# Altium schematic sheet 数粒机接收板4通道.SchDoc
size A1
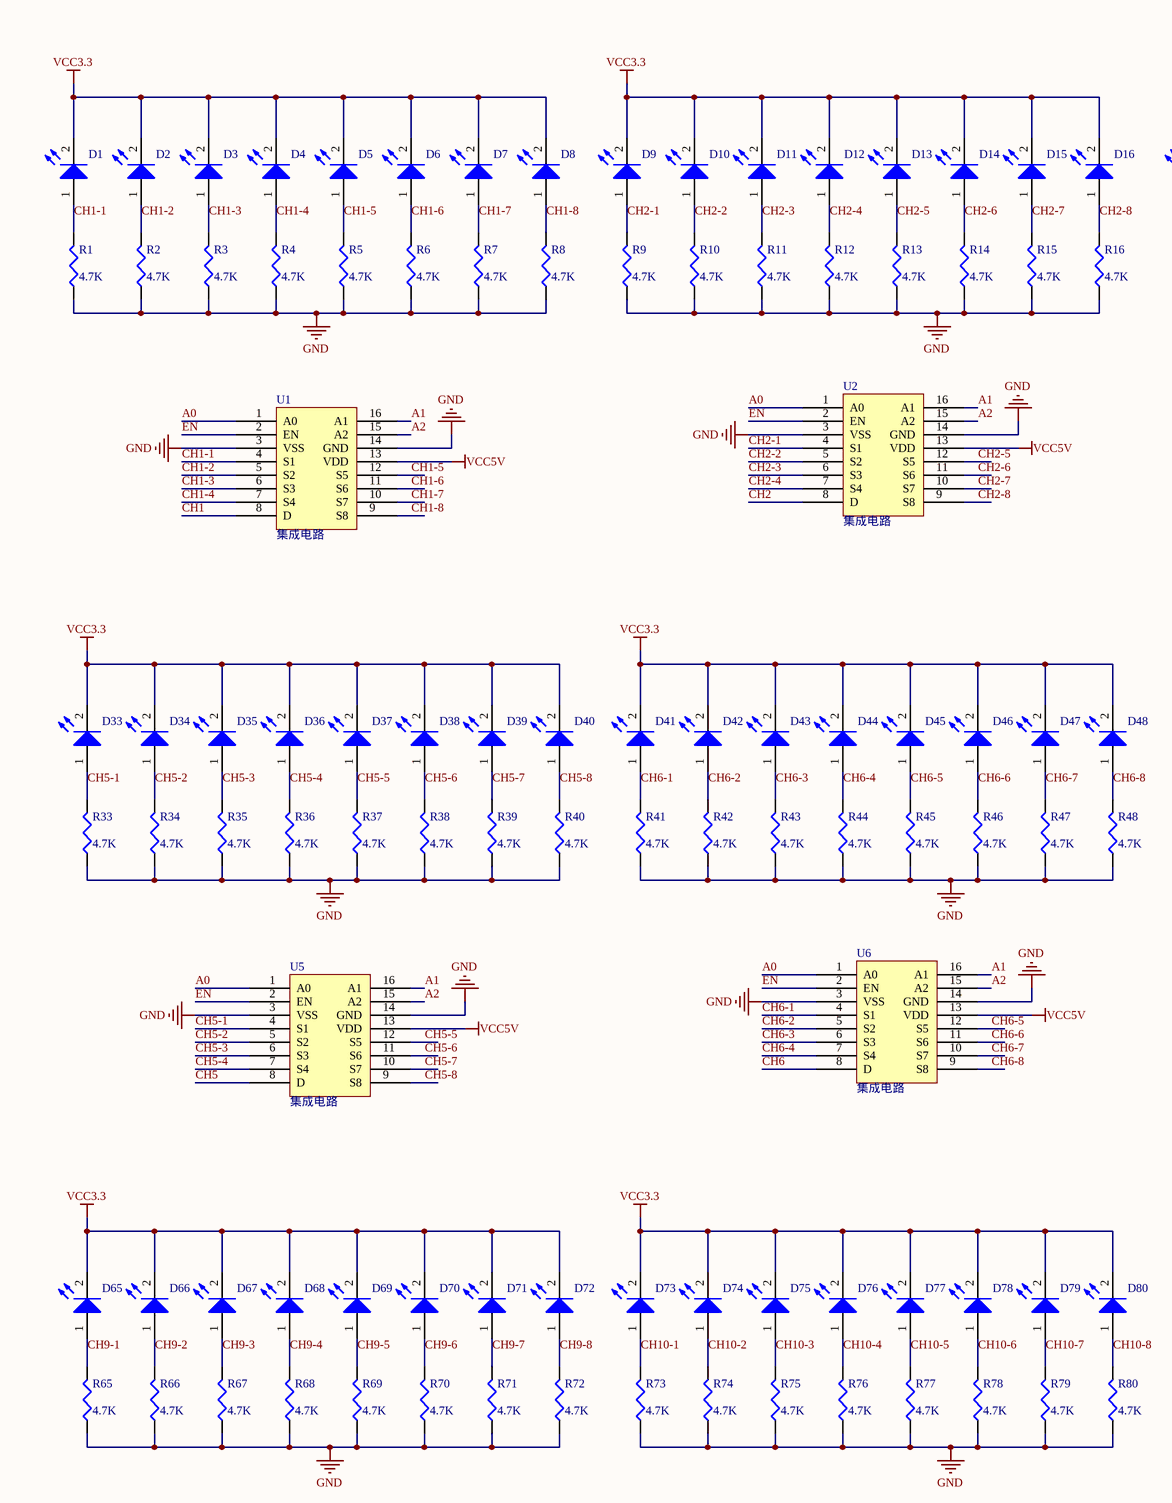
[diagram p0: 数粒机接收板4通道.SchDoc, top left]
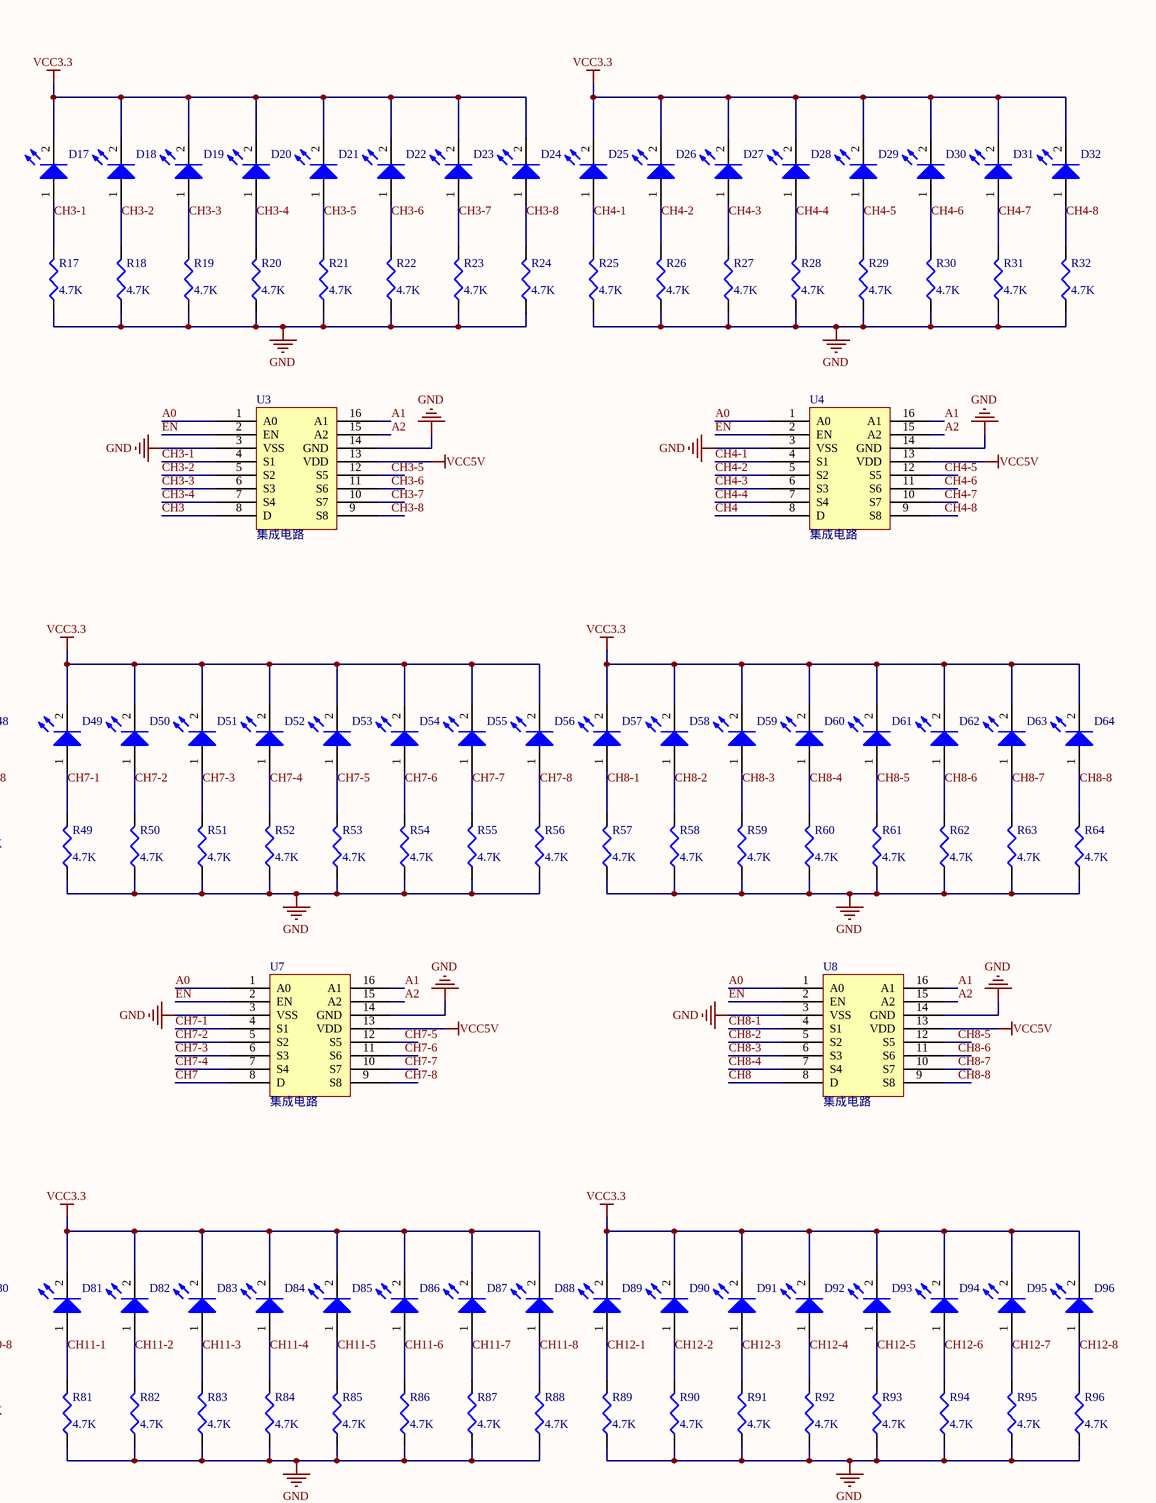
[diagram p1: 数粒机接收板4通道.SchDoc, top right]
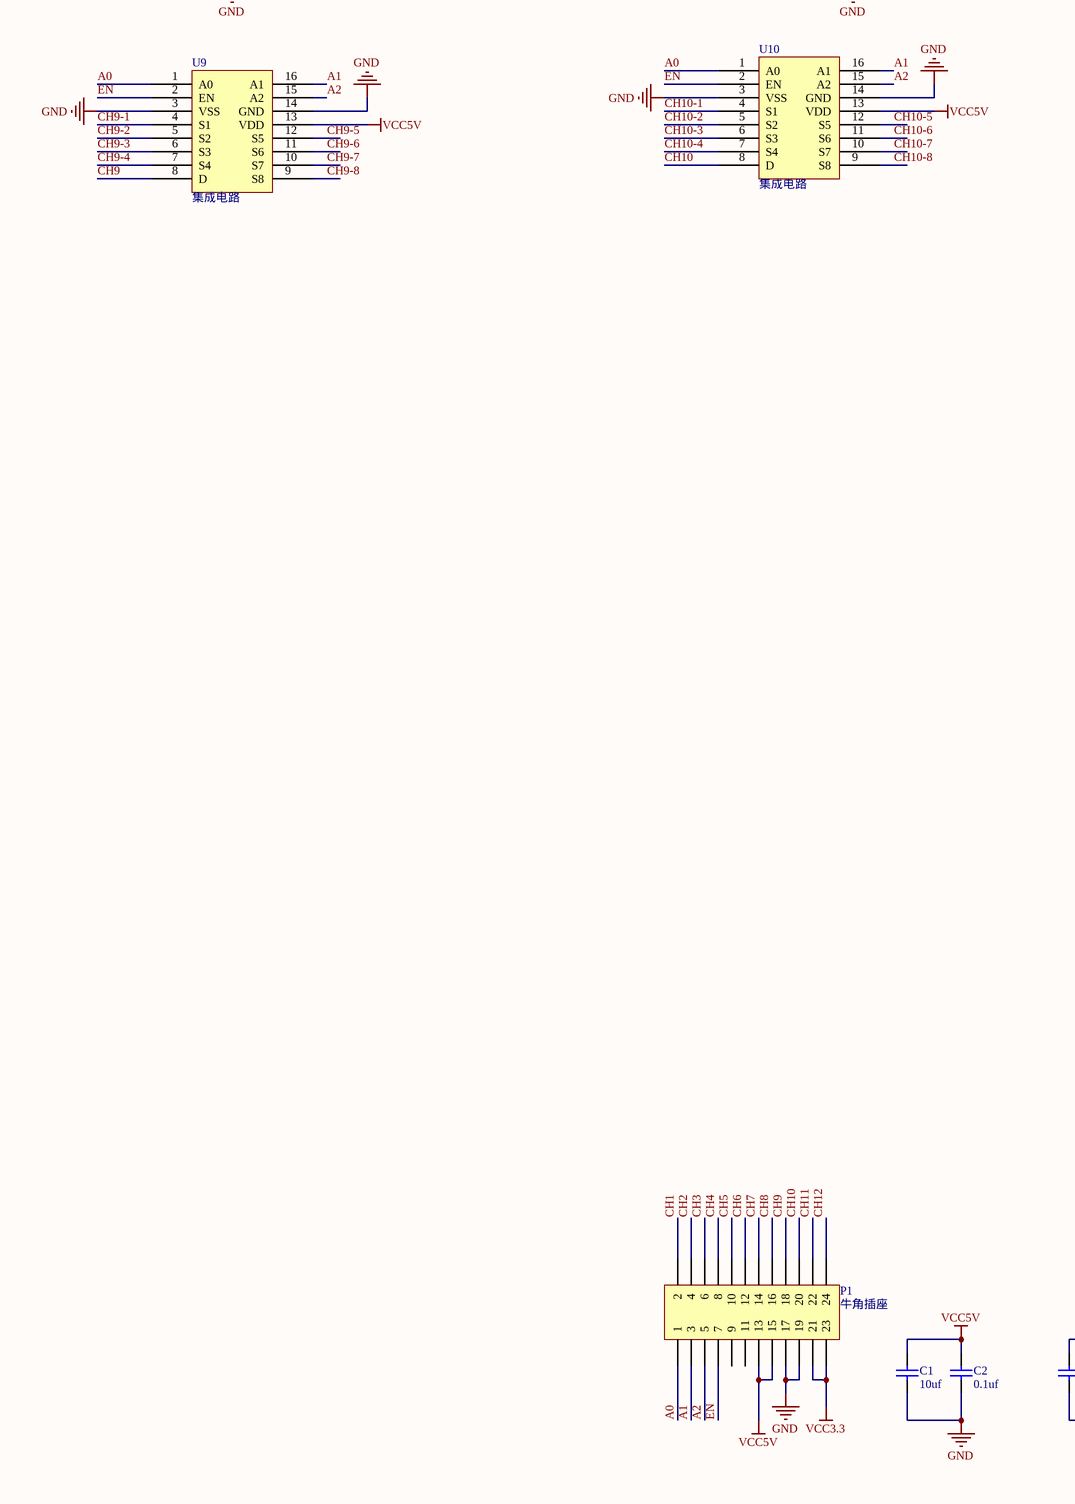
[diagram p2: 数粒机接收板4通道.SchDoc, bottom left]
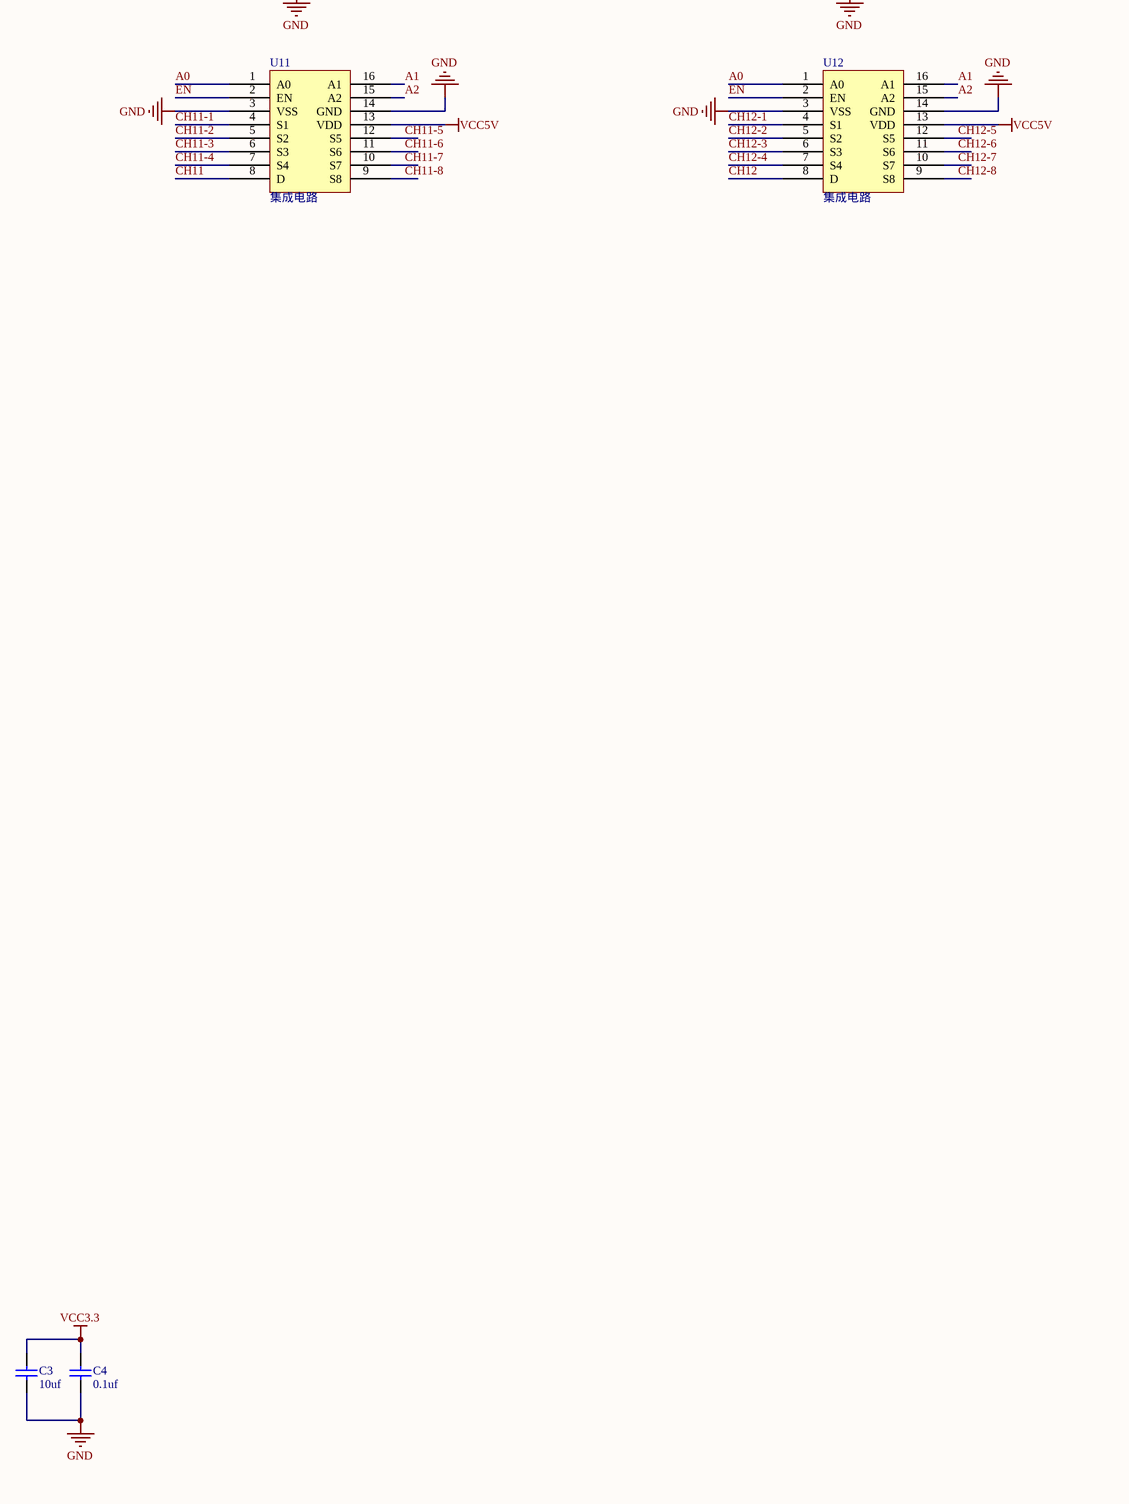
[diagram p3: 数粒机接收板4通道.SchDoc, bottom right]

## Parts
C1  value 10uf  [0805c]  (hidden comment: 贴片电容 10uf)
C2  value 0.1uf  [0805c]  (hidden comment: 贴片电容)
C3  value 10uf  [0805c]  (hidden comment: 贴片电容 10uf)
C4  value 0.1uf  [0805c]  (hidden comment: 贴片电容)
D1  红外接收珠子  [jieshou1206]  (value not drawn)
D2  红外接收珠子  [jieshou1206]  (value not drawn)
D3  红外接收珠子  [jieshou1206]  (value not drawn)
D4  红外接收珠子  [jieshou1206]  (value not drawn)
D5  红外接收珠子  [jieshou1206]  (value not drawn)
D6  红外接收珠子  [jieshou1206]  (value not drawn)
D7  红外接收珠子  [jieshou1206]  (value not drawn)
D8  红外接收珠子  [jieshou1206]  (value not drawn)
D9  红外接收珠子  [jieshou1206]  (value not drawn)
D10  红外接收珠子  [jieshou1206]  (value not drawn)
D11  红外接收珠子  [jieshou1206]  (value not drawn)
D12  红外接收珠子  [jieshou1206]  (value not drawn)
D13  红外接收珠子  [jieshou1206]  (value not drawn)
D14  红外接收珠子  [jieshou1206]  (value not drawn)
D15  红外接收珠子  [jieshou1206]  (value not drawn)
D16  红外接收珠子  [jieshou1206]  (value not drawn)
D17  红外接收珠子  [jieshou1206]  (value not drawn)
D18  红外接收珠子  [jieshou1206]  (value not drawn)
D19  红外接收珠子  [jieshou1206]  (value not drawn)
D20  红外接收珠子  [jieshou1206]  (value not drawn)
D21  红外接收珠子  [jieshou1206]  (value not drawn)
D22  红外接收珠子  [jieshou1206]  (value not drawn)
D23  红外接收珠子  [jieshou1206]  (value not drawn)
D24  红外接收珠子  [jieshou1206]  (value not drawn)
D25  红外接收珠子  [jieshou1206]  (value not drawn)
D26  红外接收珠子  [jieshou1206]  (value not drawn)
D27  红外接收珠子  [jieshou1206]  (value not drawn)
D28  红外接收珠子  [jieshou1206]  (value not drawn)
D29  红外接收珠子  [jieshou1206]  (value not drawn)
D30  红外接收珠子  [jieshou1206]  (value not drawn)
D31  红外接收珠子  [jieshou1206]  (value not drawn)
D32  红外接收珠子  [jieshou1206]  (value not drawn)
D33  红外接收珠子  [jieshou1206]  (value not drawn)
D34  红外接收珠子  [jieshou1206]  (value not drawn)
D35  红外接收珠子  [jieshou1206]  (value not drawn)
D36  红外接收珠子  [jieshou1206]  (value not drawn)
D37  红外接收珠子  [jieshou1206]  (value not drawn)
D38  红外接收珠子  [jieshou1206]  (value not drawn)
D39  红外接收珠子  [jieshou1206]  (value not drawn)
D40  红外接收珠子  [jieshou1206]  (value not drawn)
D41  红外接收珠子  [jieshou1206]  (value not drawn)
D42  红外接收珠子  [jieshou1206]  (value not drawn)
D43  红外接收珠子  [jieshou1206]  (value not drawn)
D44  红外接收珠子  [jieshou1206]  (value not drawn)
D45  红外接收珠子  [jieshou1206]  (value not drawn)
D46  红外接收珠子  [jieshou1206]  (value not drawn)
D47  红外接收珠子  [jieshou1206]  (value not drawn)
D48  红外接收珠子  [jieshou1206]  (value not drawn)
D49  红外接收珠子  [jieshou1206]  (value not drawn)
D50  红外接收珠子  [jieshou1206]  (value not drawn)
D51  红外接收珠子  [jieshou1206]  (value not drawn)
D52  红外接收珠子  [jieshou1206]  (value not drawn)
D53  红外接收珠子  [jieshou1206]  (value not drawn)
D54  红外接收珠子  [jieshou1206]  (value not drawn)
D55  红外接收珠子  [jieshou1206]  (value not drawn)
D56  红外接收珠子  [jieshou1206]  (value not drawn)
D57  红外接收珠子  [jieshou1206]  (value not drawn)
D58  红外接收珠子  [jieshou1206]  (value not drawn)
D59  红外接收珠子  [jieshou1206]  (value not drawn)
D60  红外接收珠子  [jieshou1206]  (value not drawn)
D61  红外接收珠子  [jieshou1206]  (value not drawn)
D62  红外接收珠子  [jieshou1206]  (value not drawn)
D63  红外接收珠子  [jieshou1206]  (value not drawn)
D64  红外接收珠子  [jieshou1206]  (value not drawn)
D65  红外接收珠子  [jieshou1206]  (value not drawn)
D66  红外接收珠子  [jieshou1206]  (value not drawn)
D67  红外接收珠子  [jieshou1206]  (value not drawn)
D68  红外接收珠子  [jieshou1206]  (value not drawn)
D69  红外接收珠子  [jieshou1206]  (value not drawn)
D70  红外接收珠子  [jieshou1206]  (value not drawn)
D71  红外接收珠子  [jieshou1206]  (value not drawn)
D72  红外接收珠子  [jieshou1206]  (value not drawn)
D73  红外接收珠子  [jieshou1206]  (value not drawn)
D74  红外接收珠子  [jieshou1206]  (value not drawn)
D75  红外接收珠子  [jieshou1206]  (value not drawn)
D76  红外接收珠子  [jieshou1206]  (value not drawn)
D77  红外接收珠子  [jieshou1206]  (value not drawn)
D78  红外接收珠子  [jieshou1206]  (value not drawn)
D79  红外接收珠子  [jieshou1206]  (value not drawn)
D80  红外接收珠子  [jieshou1206]  (value not drawn)
D81  红外接收珠子  [jieshou1206]  (value not drawn)
D82  红外接收珠子  [jieshou1206]  (value not drawn)
D83  红外接收珠子  [jieshou1206]  (value not drawn)
D84  红外接收珠子  [jieshou1206]  (value not drawn)
D85  红外接收珠子  [jieshou1206]  (value not drawn)
D86  红外接收珠子  [jieshou1206]  (value not drawn)
D87  红外接收珠子  [jieshou1206]  (value not drawn)
D88  红外接收珠子  [jieshou1206]  (value not drawn)
D89  红外接收珠子  [jieshou1206]  (value not drawn)
D90  红外接收珠子  [jieshou1206]  (value not drawn)
D91  红外接收珠子  [jieshou1206]  (value not drawn)
D92  红外接收珠子  [jieshou1206]  (value not drawn)
D93  红外接收珠子  [jieshou1206]  (value not drawn)
D94  红外接收珠子  [jieshou1206]  (value not drawn)
D95  红外接收珠子  [jieshou1206]  (value not drawn)
D96  红外接收珠子  [jieshou1206]  (value not drawn)
P1  牛角插座  [HDR2X12]
R1  value 4.7K  [0805r]  (hidden comment: 贴片电阻)
R2  value 4.7K  [0805r]  (hidden comment: 贴片电阻)
R3  value 4.7K  [0805r]  (hidden comment: 贴片电阻)
R4  value 4.7K  [0805r]  (hidden comment: 贴片电阻)
R5  value 4.7K  [0805r]  (hidden comment: 贴片电阻)
R6  value 4.7K  [0805r]  (hidden comment: 贴片电阻)
R7  value 4.7K  [0805r]  (hidden comment: 贴片电阻)
R8  value 4.7K  [0805r]  (hidden comment: 贴片电阻)
R9  value 4.7K  [0805r]  (hidden comment: 贴片电阻)
R10  value 4.7K  [0805r]  (hidden comment: 贴片电阻)
R11  value 4.7K  [0805r]  (hidden comment: 贴片电阻)
R12  value 4.7K  [0805r]  (hidden comment: 贴片电阻)
R13  value 4.7K  [0805r]  (hidden comment: 贴片电阻)
R14  value 4.7K  [0805r]  (hidden comment: 贴片电阻)
R15  value 4.7K  [0805r]  (hidden comment: 贴片电阻)
R16  value 4.7K  [0805r]  (hidden comment: 贴片电阻)
R17  value 4.7K  [0805r]  (hidden comment: 贴片电阻)
R18  value 4.7K  [0805r]  (hidden comment: 贴片电阻)
R19  value 4.7K  [0805r]  (hidden comment: 贴片电阻)
R20  value 4.7K  [0805r]  (hidden comment: 贴片电阻)
R21  value 4.7K  [0805r]  (hidden comment: 贴片电阻)
R22  value 4.7K  [0805r]  (hidden comment: 贴片电阻)
R23  value 4.7K  [0805r]  (hidden comment: 贴片电阻)
R24  value 4.7K  [0805r]  (hidden comment: 贴片电阻)
R25  value 4.7K  [0805r]  (hidden comment: 贴片电阻)
R26  value 4.7K  [0805r]  (hidden comment: 贴片电阻)
R27  value 4.7K  [0805r]  (hidden comment: 贴片电阻)
R28  value 4.7K  [0805r]  (hidden comment: 贴片电阻)
R29  value 4.7K  [0805r]  (hidden comment: 贴片电阻)
R30  value 4.7K  [0805r]  (hidden comment: 贴片电阻)
R31  value 4.7K  [0805r]  (hidden comment: 贴片电阻)
R32  value 4.7K  [0805r]  (hidden comment: 贴片电阻)
R33  value 4.7K  [0805r]  (hidden comment: 贴片电阻)
R34  value 4.7K  [0805r]  (hidden comment: 贴片电阻)
R35  value 4.7K  [0805r]  (hidden comment: 贴片电阻)
R36  value 4.7K  [0805r]  (hidden comment: 贴片电阻)
R37  value 4.7K  [0805r]  (hidden comment: 贴片电阻)
R38  value 4.7K  [0805r]  (hidden comment: 贴片电阻)
R39  value 4.7K  [0805r]  (hidden comment: 贴片电阻)
R40  value 4.7K  [0805r]  (hidden comment: 贴片电阻)
R41  value 4.7K  [0805r]  (hidden comment: 贴片电阻)
R42  value 4.7K  [0805r]  (hidden comment: 贴片电阻)
R43  value 4.7K  [0805r]  (hidden comment: 贴片电阻)
R44  value 4.7K  [0805r]  (hidden comment: 贴片电阻)
R45  value 4.7K  [0805r]  (hidden comment: 贴片电阻)
R46  value 4.7K  [0805r]  (hidden comment: 贴片电阻)
R47  value 4.7K  [0805r]  (hidden comment: 贴片电阻)
R48  value 4.7K  [0805r]  (hidden comment: 贴片电阻)
R49  value 4.7K  [0805r]  (hidden comment: 贴片电阻)
R50  value 4.7K  [0805r]  (hidden comment: 贴片电阻)
R51  value 4.7K  [0805r]  (hidden comment: 贴片电阻)
R52  value 4.7K  [0805r]  (hidden comment: 贴片电阻)
R53  value 4.7K  [0805r]  (hidden comment: 贴片电阻)
R54  value 4.7K  [0805r]  (hidden comment: 贴片电阻)
R55  value 4.7K  [0805r]  (hidden comment: 贴片电阻)
R56  value 4.7K  [0805r]  (hidden comment: 贴片电阻)
R57  value 4.7K  [0805r]  (hidden comment: 贴片电阻)
R58  value 4.7K  [0805r]  (hidden comment: 贴片电阻)
R59  value 4.7K  [0805r]  (hidden comment: 贴片电阻)
R60  value 4.7K  [0805r]  (hidden comment: 贴片电阻)
R61  value 4.7K  [0805r]  (hidden comment: 贴片电阻)
R62  value 4.7K  [0805r]  (hidden comment: 贴片电阻)
R63  value 4.7K  [0805r]  (hidden comment: 贴片电阻)
R64  value 4.7K  [0805r]  (hidden comment: 贴片电阻)
R65  value 4.7K  [0805r]  (hidden comment: 贴片电阻)
R66  value 4.7K  [0805r]  (hidden comment: 贴片电阻)
R67  value 4.7K  [0805r]  (hidden comment: 贴片电阻)
R68  value 4.7K  [0805r]  (hidden comment: 贴片电阻)
R69  value 4.7K  [0805r]  (hidden comment: 贴片电阻)
R70  value 4.7K  [0805r]  (hidden comment: 贴片电阻)
R71  value 4.7K  [0805r]  (hidden comment: 贴片电阻)
R72  value 4.7K  [0805r]  (hidden comment: 贴片电阻)
R73  value 4.7K  [0805r]  (hidden comment: 贴片电阻)
R74  value 4.7K  [0805r]  (hidden comment: 贴片电阻)
R75  value 4.7K  [0805r]  (hidden comment: 贴片电阻)
R76  value 4.7K  [0805r]  (hidden comment: 贴片电阻)
R77  value 4.7K  [0805r]  (hidden comment: 贴片电阻)
R78  value 4.7K  [0805r]  (hidden comment: 贴片电阻)
R79  value 4.7K  [0805r]  (hidden comment: 贴片电阻)
R80  value 4.7K  [0805r]  (hidden comment: 贴片电阻)
R81  value 4.7K  [0805r]  (hidden comment: 贴片电阻)
R82  value 4.7K  [0805r]  (hidden comment: 贴片电阻)
R83  value 4.7K  [0805r]  (hidden comment: 贴片电阻)
R84  value 4.7K  [0805r]  (hidden comment: 贴片电阻)
R85  value 4.7K  [0805r]  (hidden comment: 贴片电阻)
R86  value 4.7K  [0805r]  (hidden comment: 贴片电阻)
R87  value 4.7K  [0805r]  (hidden comment: 贴片电阻)
R88  value 4.7K  [0805r]  (hidden comment: 贴片电阻)
R89  value 4.7K  [0805r]  (hidden comment: 贴片电阻)
R90  value 4.7K  [0805r]  (hidden comment: 贴片电阻)
R91  value 4.7K  [0805r]  (hidden comment: 贴片电阻)
R92  value 4.7K  [0805r]  (hidden comment: 贴片电阻)
R93  value 4.7K  [0805r]  (hidden comment: 贴片电阻)
R94  value 4.7K  [0805r]  (hidden comment: 贴片电阻)
R95  value 4.7K  [0805r]  (hidden comment: 贴片电阻)
R96  value 4.7K  [0805r]  (hidden comment: 贴片电阻)
U1  集成电路  [TSSOP16]
U2  集成电路  [TSSOP16]
U3  集成电路  [TSSOP16]
U4  集成电路  [TSSOP16]
U5  集成电路  [TSSOP16]
U6  集成电路  [TSSOP16]
U7  集成电路  [TSSOP16]
U8  集成电路  [TSSOP16]
U9  集成电路  [TSSOP16]
U10  集成电路  [TSSOP16]
U11  集成电路  [TSSOP16]
U12  集成电路  [TSSOP16]

## Nets
GND: C1.1 C2.1 C3.1 C4.1 P1.17 P1.19 R1.1 R2.1 R3.1 R4.1 R5.1 R6.1 R7.1 R8.1 R9.1 R10.1 R11.1 R12.1 R13.1 R14.1 R15.1 R16.1 R17.1 R18.1 R19.1 R20.1 R21.1 R22.1 R23.1 R24.1 R25.1 R26.1 R27.1 R28.1 R29.1 R30.1 R31.1 R32.1 R33.1 R34.1 R35.1 R36.1 R37.1 R38.1 R39.1 R40.1 R41.1 R42.1 R43.1 R44.1 R45.1 R46.1 R47.1 R48.1 R49.1 R50.1 R51.1 R52.1 R53.1 R54.1 R55.1 R56.1 R57.1 R58.1 R59.1 R60.1 R61.1 R62.1 R63.1 R64.1 R65.1 R66.1 R67.1 R68.1 R69.1 R70.1 R71.1 R72.1 R73.1 R74.1 R75.1 R76.1 R77.1 R78.1 R79.1 R80.1 R81.1 R82.1 R83.1 R84.1 R85.1 R86.1 R87.1 R88.1 R89.1 R90.1 R91.1 R92.1 R93.1 R94.1 R95.1 R96.1 U1.3(VSS) U1.14(GND) U2.3(VSS) U2.14(GND) U3.3(VSS) U3.14(GND) U4.3(VSS) U4.14(GND) U5.3(VSS) U5.14(GND) U6.3(VSS) U6.14(GND) U7.3(VSS) U7.14(GND) U8.3(VSS) U8.14(GND) U9.3(VSS) U9.14(GND) U10.3(VSS) U10.14(GND) U11.3(VSS) U11.14(GND) U12.3(VSS) U12.14(GND)
VCC3.3: C3.2 C4.2 D1.2(K) D2.2(K) D3.2(K) D4.2(K) D5.2(K) D6.2(K) D7.2(K) D8.2(K) D9.2(K) D10.2(K) D11.2(K) D12.2(K) D13.2(K) D14.2(K) D15.2(K) D16.2(K) D17.2(K) D18.2(K) D19.2(K) D20.2(K) D21.2(K) D22.2(K) D23.2(K) D24.2(K) D25.2(K) D26.2(K) D27.2(K) D28.2(K) D29.2(K) D30.2(K) D31.2(K) D32.2(K) D33.2(K) D34.2(K) D35.2(K) D36.2(K) D37.2(K) D38.2(K) D39.2(K) D40.2(K) D41.2(K) D42.2(K) D43.2(K) D44.2(K) D45.2(K) D46.2(K) D47.2(K) D48.2(K) D49.2(K) D50.2(K) D51.2(K) D52.2(K) D53.2(K) D54.2(K) D55.2(K) D56.2(K) D57.2(K) D58.2(K) D59.2(K) D60.2(K) D61.2(K) D62.2(K) D63.2(K) D64.2(K) D65.2(K) D66.2(K) D67.2(K) D68.2(K) D69.2(K) D70.2(K) D71.2(K) D72.2(K) D73.2(K) D74.2(K) D75.2(K) D76.2(K) D77.2(K) D78.2(K) D79.2(K) D80.2(K) D81.2(K) D82.2(K) D83.2(K) D84.2(K) D85.2(K) D86.2(K) D87.2(K) D88.2(K) D89.2(K) D90.2(K) D91.2(K) D92.2(K) D93.2(K) D94.2(K) D95.2(K) D96.2(K) P1.21 P1.23
VCC5V: C1.2 C2.2 P1.13 P1.15 U1.13(VDD) U2.13(VDD) U3.13(VDD) U4.13(VDD) U5.13(VDD) U6.13(VDD) U7.13(VDD) U8.13(VDD) U9.13(VDD) U10.13(VDD) U11.13(VDD) U12.13(VDD)
A0: P1.1 U1.1(A0) U2.1(A0) U3.1(A0) U4.1(A0) U5.1(A0) U6.1(A0) U7.1(A0) U8.1(A0) U9.1(A0) U10.1(A0) U11.1(A0) U12.1(A0)
A1: P1.3 U1.16(A1) U2.16(A1) U3.16(A1) U4.16(A1) U5.16(A1) U6.16(A1) U7.16(A1) U8.16(A1) U9.16(A1) U10.16(A1) U11.16(A1) U12.16(A1)
A2: P1.5 U1.15(A2) U2.15(A2) U3.15(A2) U4.15(A2) U5.15(A2) U6.15(A2) U7.15(A2) U8.15(A2) U9.15(A2) U10.15(A2) U11.15(A2) U12.15(A2)
CH1: P1.2 U1.8(D)
CH1-1: D1.1(A) R1.2 U1.4(S1)
CH1-2: D2.1(A) R2.2 U1.5(S2)
CH1-3: D3.1(A) R3.2 U1.6(S3)
CH1-4: D4.1(A) R4.2 U1.7(S4)
CH1-5: D5.1(A) R5.2 U1.12(S5)
CH1-6: D6.1(A) R6.2 U1.11(S6)
CH1-7: D7.1(A) R7.2 U1.10(S7)
CH1-8: D8.1(A) R8.2 U1.9(S8)
CH2: P1.4 U2.8(D)
CH2-1: D9.1(A) R9.2 U2.4(S1)
CH2-2: D10.1(A) R10.2 U2.5(S2)
CH2-3: D11.1(A) R11.2 U2.6(S3)
CH2-4: D12.1(A) R12.2 U2.7(S4)
CH2-5: D13.1(A) R13.2 U2.12(S5)
CH2-6: D14.1(A) R14.2 U2.11(S6)
CH2-7: D15.1(A) R15.2 U2.10(S7)
CH2-8: D16.1(A) R16.2 U2.9(S8)
CH3: P1.6 U3.8(D)
CH3-1: D17.1(A) R17.2 U3.4(S1)
CH3-2: D18.1(A) R18.2 U3.5(S2)
CH3-3: D19.1(A) R19.2 U3.6(S3)
CH3-4: D20.1(A) R20.2 U3.7(S4)
CH3-5: D21.1(A) R21.2 U3.12(S5)
CH3-6: D22.1(A) R22.2 U3.11(S6)
CH3-7: D23.1(A) R23.2 U3.10(S7)
CH3-8: D24.1(A) R24.2 U3.9(S8)
CH4: P1.8 U4.8(D)
CH4-1: D25.1(A) R25.2 U4.4(S1)
CH4-2: D26.1(A) R26.2 U4.5(S2)
CH4-3: D27.1(A) R27.2 U4.6(S3)
CH4-4: D28.1(A) R28.2 U4.7(S4)
CH4-5: D29.1(A) R29.2 U4.12(S5)
CH4-6: D30.1(A) R30.2 U4.11(S6)
CH4-7: D31.1(A) R31.2 U4.10(S7)
CH4-8: D32.1(A) R32.2 U4.9(S8)
CH5: P1.10 U5.8(D)
CH5-1: D33.1(A) R33.2 U5.4(S1)
CH5-2: D34.1(A) R34.2 U5.5(S2)
CH5-3: D35.1(A) R35.2 U5.6(S3)
CH5-4: D36.1(A) R36.2 U5.7(S4)
CH5-5: D37.1(A) R37.2 U5.12(S5)
CH5-6: D38.1(A) R38.2 U5.11(S6)
CH5-7: D39.1(A) R39.2 U5.10(S7)
CH5-8: D40.1(A) R40.2 U5.9(S8)
CH6: P1.12 U6.8(D)
CH6-1: D41.1(A) R41.2 U6.4(S1)
CH6-2: D42.1(A) R42.2 U6.5(S2)
CH6-3: D43.1(A) R43.2 U6.6(S3)
CH6-4: D44.1(A) R44.2 U6.7(S4)
CH6-5: D45.1(A) R45.2 U6.12(S5)
CH6-6: D46.1(A) R46.2 U6.11(S6)
CH6-7: D47.1(A) R47.2 U6.10(S7)
CH6-8: D48.1(A) R48.2 U6.9(S8)
CH7: P1.14 U7.8(D)
CH7-1: D49.1(A) R49.2 U7.4(S1)
CH7-2: D50.1(A) R50.2 U7.5(S2)
CH7-3: D51.1(A) R51.2 U7.6(S3)
CH7-4: D52.1(A) R52.2 U7.7(S4)
CH7-5: D53.1(A) R53.2 U7.12(S5)
CH7-6: D54.1(A) R54.2 U7.11(S6)
CH7-7: D55.1(A) R55.2 U7.10(S7)
CH7-8: D56.1(A) R56.2 U7.9(S8)
CH8: P1.16 U8.8(D)
CH8-1: D57.1(A) R57.2 U8.4(S1)
CH8-2: D58.1(A) R58.2 U8.5(S2)
CH8-3: D59.1(A) R59.2 U8.6(S3)
CH8-4: D60.1(A) R60.2 U8.7(S4)
CH8-5: D61.1(A) R61.2 U8.12(S5)
CH8-6: D62.1(A) R62.2 U8.11(S6)
CH8-7: D63.1(A) R63.2 U8.10(S7)
CH8-8: D64.1(A) R64.2 U8.9(S8)
CH9: P1.18 U9.8(D)
CH9-1: D65.1(A) R65.2 U9.4(S1)
CH9-2: D66.1(A) R66.2 U9.5(S2)
CH9-3: D67.1(A) R67.2 U9.6(S3)
CH9-4: D68.1(A) R68.2 U9.7(S4)
CH9-5: D69.1(A) R69.2 U9.12(S5)
CH9-6: D70.1(A) R70.2 U9.11(S6)
CH9-7: D71.1(A) R71.2 U9.10(S7)
CH9-8: D72.1(A) R72.2 U9.9(S8)
CH10: P1.20 U10.8(D)
CH10-1: D73.1(A) R73.2 U10.4(S1)
CH10-2: D74.1(A) R74.2 U10.5(S2)
CH10-3: D75.1(A) R75.2 U10.6(S3)
CH10-4: D76.1(A) R76.2 U10.7(S4)
CH10-5: D77.1(A) R77.2 U10.12(S5)
CH10-6: D78.1(A) R78.2 U10.11(S6)
CH10-7: D79.1(A) R79.2 U10.10(S7)
CH10-8: D80.1(A) R80.2 U10.9(S8)
CH11: P1.22 U11.8(D)
CH11-1: D81.1(A) R81.2 U11.4(S1)
CH11-2: D82.1(A) R82.2 U11.5(S2)
CH11-3: D83.1(A) R83.2 U11.6(S3)
CH11-4: D84.1(A) R84.2 U11.7(S4)
CH11-5: D85.1(A) R85.2 U11.12(S5)
CH11-6: D86.1(A) R86.2 U11.11(S6)
CH11-7: D87.1(A) R87.2 U11.10(S7)
CH11-8: D88.1(A) R88.2 U11.9(S8)
CH12: P1.24 U12.8(D)
CH12-1: D89.1(A) R89.2 U12.4(S1)
CH12-2: D90.1(A) R90.2 U12.5(S2)
CH12-3: D91.1(A) R91.2 U12.6(S3)
CH12-4: D92.1(A) R92.2 U12.7(S4)
CH12-5: D93.1(A) R93.2 U12.12(S5)
CH12-6: D94.1(A) R94.2 U12.11(S6)
CH12-7: D95.1(A) R95.2 U12.10(S7)
CH12-8: D96.1(A) R96.2 U12.9(S8)
EN: P1.7 U1.2(EN) U2.2(EN) U3.2(EN) U4.2(EN) U5.2(EN) U6.2(EN) U7.2(EN) U8.2(EN) U9.2(EN) U10.2(EN) U11.2(EN) U12.2(EN)

Not connected (* = marked no-connect by the designer): P1 9 11

## Library data of the parts
C1 C3 = Cap: Capacitor; Published: 8-Jun-2000; LatestRevisionDate: 17-Jul-2002; LatestRevisionNote: Re-released for DXP Platform.; PackageReference: RAD-0.3; Publisher: Altium Limited
C2 C4 = Cap: Capacitor 0.1uf; Published: 8-Jun-2000; LatestRevisionDate: 17-Jul-2002; LatestRevisionNote: Re-released for DXP Platform.; PackageReference: RAD-0.3; Publisher: Altium Limited
D1-D96 = LED0: PD15-21B/TR8; Published: 8-Jun-2000; LatestRevisionDate: 08-Jul-2005; LatestRevisionNote: Mech Layer 1 removed.; PackageReference: LED-0; Publisher: Altium Limited
P1 = Header 12X2: Header, 12-Pin, Dual row; LatestRevisionDate: 17-Jul-2002; LatestRevisionNote: Re-released for DXP Platform.; Publisher: Altium Limited
R1-R96 = Res3: 电阻; Published: 8-Jun-2000; LatestRevisionDate: 29-May-2009; LatestRevisionNote: IPC-7351 Footprint Added.; PackageReference: J1-0603; Publisher: Altium Limited; PackageDescription: Chip Resistor
U1-U12 = ADG708: ADG708BRU-REEL